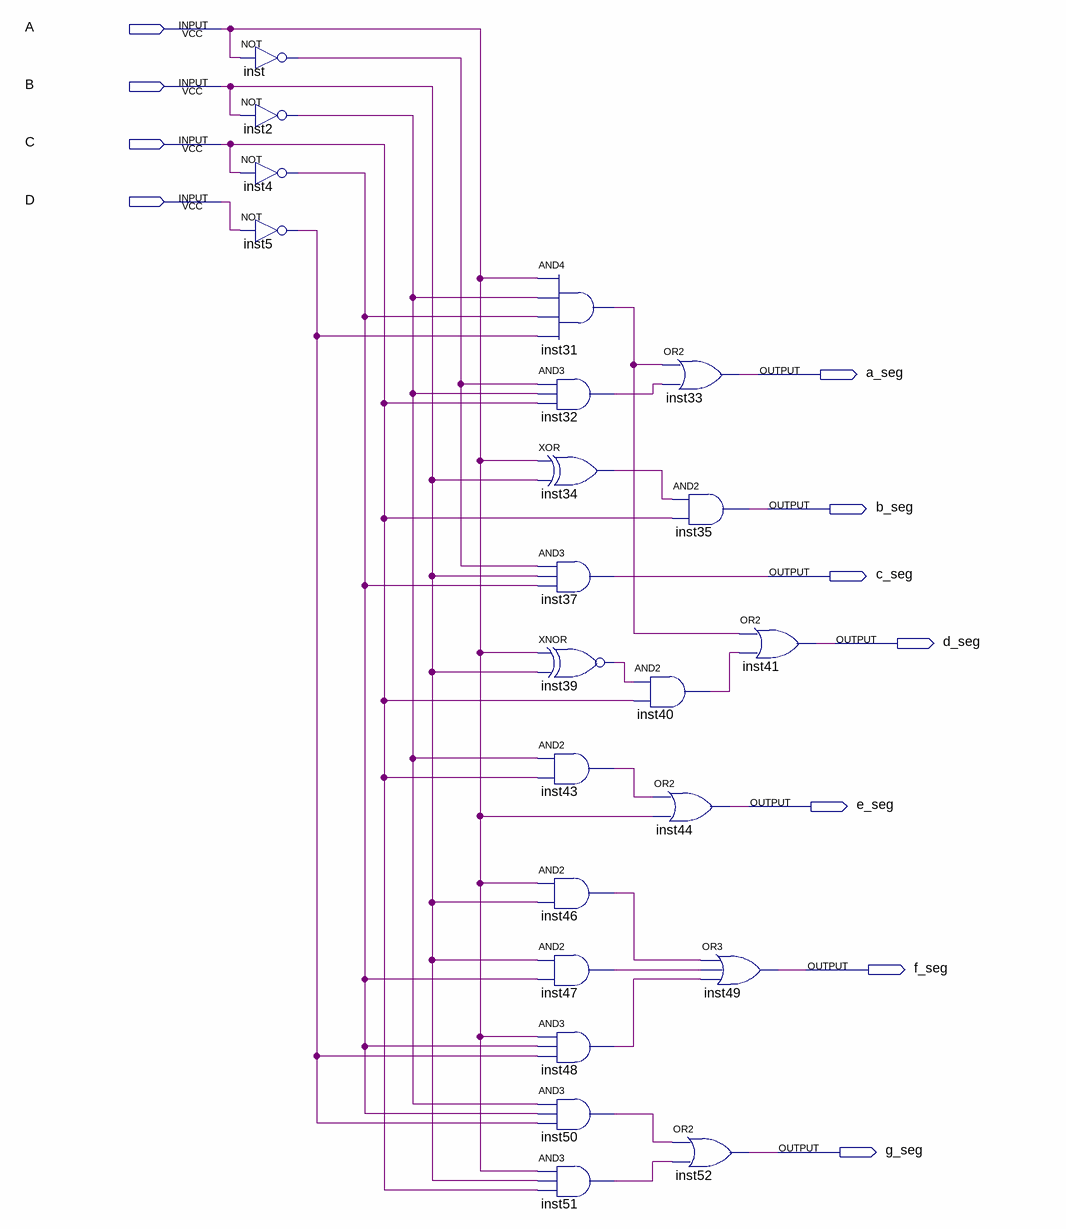
[diagram p0: schematic sheet]
// Quartus schematic Decodificator.bdf as structural Verilog: 22 symbols, 11 pins
module Decodificator (
  input  A,
  input  B,
  input  C,
  input  D,
  output a_seg,
  output b_seg,
  output c_seg,
  output d_seg,
  output e_seg,
  output f_seg,
  output g_seg
);

  wire inst2_out, inst4_out, inst5_out, inst31_out, inst32_out, inst34_out, inst39_out, inst40_out,
       inst43_out, inst46_out, inst47_out, inst48_out, inst50_out, inst51_out, inst_out;

  not inst (inst_out, A);
  not inst2 (inst2_out, B);
  not inst4 (inst4_out, C);
  not inst5 (inst5_out, D);
  and inst31 (inst31_out, A, inst2_out, inst4_out, inst5_out);
  and inst32 (inst32_out, inst_out, inst2_out, C);
  xor inst34 (inst34_out, A, B);
  and inst37 (c_seg, inst_out, B, inst4_out);
  xnor inst39 (inst39_out, A, B);
  and inst43 (inst43_out, inst2_out, C);
  and inst46 (inst46_out, A, B);
  and inst47 (inst47_out, B, inst4_out);
  and inst48 (inst48_out, A, inst4_out, inst5_out);
  and inst50 (inst50_out, inst2_out, inst4_out, inst5_out);
  and inst51 (inst51_out, A, B, C);
  and inst40 (inst40_out, inst39_out, C);
  or inst33 (a_seg, inst31_out, inst32_out);
  and inst35 (b_seg, inst34_out, C);
  or inst44 (e_seg, inst43_out, A);
  or inst49 (f_seg, inst46_out, inst47_out, inst48_out);
  or inst52 (g_seg, inst50_out, inst51_out);
  or inst41 (d_seg, inst31_out, inst40_out);
endmodule
